# Altium project Single-Ended to Differential Converter v1.0.0.PrjPcb
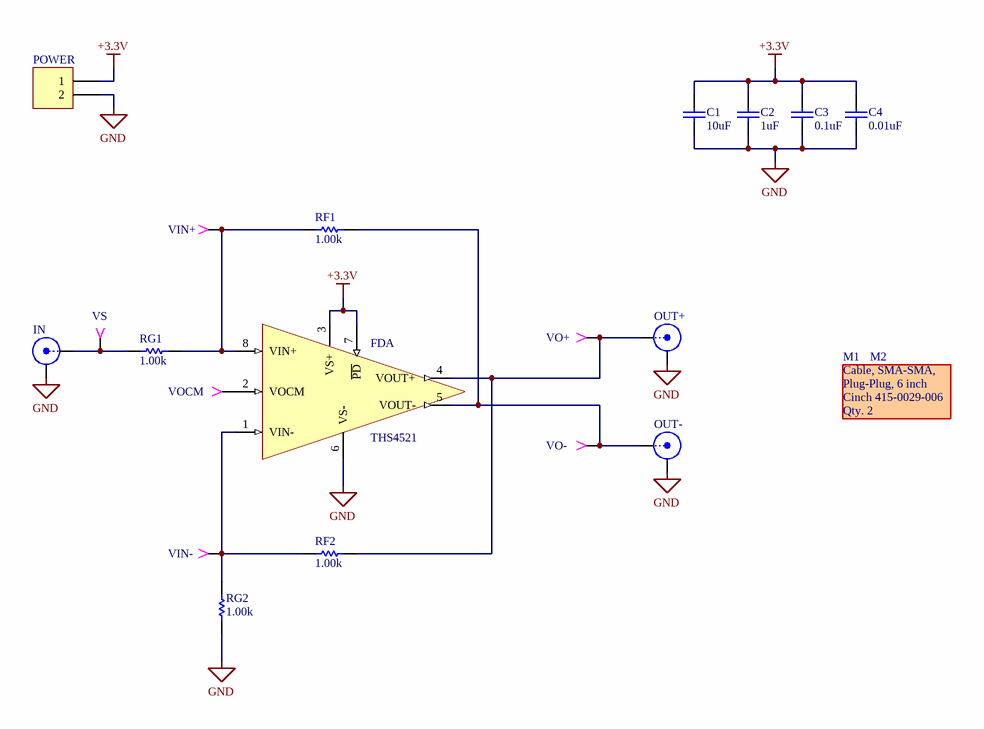
[diagram p0: SE2D v1.0.0.SchDoc]
sheetcount: 1; revisionfull: v1.0.0; revision: v1.0
1 sheet, 21 parts. Net scope: global (net labels, ports and power ports of the same name join across sheets).
Board file: SE2D v1.0.PcbDoc

## Sheet SE2D v1.0.0.SchDoc: PSDT: Single-Ended to Differential Adapter
size Letter; CompanyName: Probe-Scope; Organization: Probe-Scope; Address1: Probe-Scope: Unified USB; Address2: Oscilloscope Probe; Address3: ©2019 M. Omo, J. Rowley,; Address4: K. Hall, released under the; DocumentNumber: SCH0021; SheetNumber: 1; SheetTotal: 1; PageSetup: Record=PageOptions|CenterHorizontal=True|CenterVertical=True|PrintScale=0.96|XCorrection=1.00|YCorrection=1.00|PrintKind=1|BorderSize=5000000|LeftOffset=0|BottomOffset=0|Orientation=2|PaperLength=1000|PaperWidth=1000|Scale=100|PaperSource=7|PrintQuality=-4|MediaType=1|DitherType=10|PaperKind=11x17|PrintScaleMode=1; Assembly: ASP0021; License: CERN OHL v1.2

### Parts
C1  value 10uF  [0603(1608)]  (hidden comment: 25V)
C2  value 1uF  [0603(1608)]  (hidden comment: 25V)
C3  value 0.1uF  [0603(1608)]  (hidden comment: 50V)
C4  value 0.01uF  [0603(1608)]  (hidden comment: 50V)
FDA  THS4521  [TI_D0008A]
IN  R/A  [BNC - Right Angle]  (value not drawn)
M1  Qty. 2  Class: Cable, SMA-SMA,  Type: Plug-Plug, 6 inch  Other: Cinch 415-0029-006  (mechanical)
M2  Qty. 2  Class: Cable, SMA-SMA,  Type: Plug-Plug, 6 inch  Other: Cinch 415-0029-006  (mechanical)
OUT+  SMA-J-P-H-ST-EM1  [*SMA-J-P-H-ST-EM1_SMA-J-P-H-ST-EM1(Primary)]  (value not drawn)
OUT-  SMA-J-P-H-ST-EM1  [*SMA-J-P-H-ST-EM1_SMA-J-P-H-ST-EM1(Primary)]  (value not drawn)
POWER  *  [0.1HDR1X2P]  (value not drawn)
RF1  value 1.00k  [0603(1608)]  (hidden comment: Res1)
RF2  value 1.00k  [0603(1608)]  (hidden comment: Res1)
RG1  value 1.00k  [0603(1608)]  (hidden comment: Res1)
RG2  value 1.00k  [0603(1608)]  (hidden comment: Res1)
VIN+  TP  [TESTPOINT024]  (value not drawn)
VIN-  TP  [TESTPOINT024]  (value not drawn)
VO+  TP  [TESTPOINT024]  (value not drawn)
VO-  TP  [TESTPOINT024]  (value not drawn)
VOCM  TP  [TESTPOINT024]  (value not drawn)
VS  TP  [TESTPOINT024]  (value not drawn)

### Nets
+3.3V: C1.2 C2.2 C3.2 C4.2 FDA.3(VS+) FDA.7(~{PD}) POWER.1
GND: C1.1 C2.1 C3.1 C4.1 FDA.6(VS-) IN.2(Y) OUT+.2(Y) OUT-.2(Y) POWER.2 RG2.1
NetFDA_1: FDA.1(VIN-) RF2.1 RG2.2 VIN-.1
NetFDA_2: FDA.2(VOCM) VOCM.1
NetFDA_4: FDA.4(VOUT+) OUT+.1(X) RF2.2 VO+.1
NetFDA_5: FDA.5(VOUT-) OUT-.1(X) RF1.2 VO-.1
NetFDA_8: FDA.8(VIN+) RF1.1 RG1.2 VIN+.1
NetIN_1: IN.1(X) RG1.1 VS.1

### Notes on the sheet
- Title:
- Asm:
- Date:
- Variant:
- Time:
- Number:
- Sheet
- of
- Rev:
- File:

### Library data of the parts
C1 = 1306: Key: 1306; MENG_PN: ???1306; MANF: Samsung Electro-Mechanics; MANF_PN: CL10A106MA8NRNC; VENDOR: Digikey; VENDOR_PN: 1276-1869-1-ND; P&V Description: Capacitor, Ceramic, 10uF, 25V, 20% Tol, 85C, X5R, 0603, SMD; Class: Capacitor; Type: Ceramic; Other: X5R; Tolerance: 20; Voltage: 25; Max Temperature: 85; Approved: True; Package: 0603; SMD: True; Date Modified: 3/3/2015 11:08:29 AM; Modified By: sotterbacher; Parent Key: 1306; Verified: True
C2 = 1145: Key: 1145; MENG_PN: ???1145; MANF: Taiyo Yuden; MANF_PN: TMK107BJ105KA-T; VENDOR: Digikey; VENDOR_PN: 587-1248-1-ND; P&V Description: Capacitor, Ceramic, 1uF, 25V, 10% Tol, 125C, X5R, 0603, SMD; Class: Capacitor; Type: Ceramic; Other: X5R; Tolerance: 10; Voltage: 25; Max Temperature: 125; Approved: True; Package: 0603; SMD: True; Date Modified: 5/24/2014 3:50:24 PM; Modified By: pmarcus; Parent Key: 1145; Verified: True
C3 = 751: Key: 751; MENG_PN: ???751; MANF: Samsung Electro-Mechanics; MANF_PN: CL10B104KB8SFNC; VENDOR: Digikey; VENDOR_PN: 1276-1936-1-ND; P&V Description: Capacitor, Ceramic, 0.1uF, 50V, 10% Tol, 125C, X7R, 0603, SMD; Class: Capacitor; Type: Ceramic; Other: X7R; Tolerance: 10; Voltage: 50; Max Temperature: 125; Approved: True; Package: 0603; SMD: True; Date Modified: 10/21/2014 3:48:37 PM; Modified By: pmarcus; Parent Key: 751; Verified: True
C4 = 1703: Key: 1703; MENG_PN: ???1703; MANF: Samsung Electro-Mechanics; MANF_PN: CL10B103KB8NCNC; VENDOR: Digikey; VENDOR_PN: 1276-1921-1-ND; P&V Description: Capacitor, Ceramic, 0.01uF, 50V, 10% Tol, 125C, X7R, 0603, SMD; Class: Capacitor; Type: Ceramic; Other: X7R; Tolerance: 10; Voltage: 50; Max Temperature: 125; Approved: False; Package: 0603; SMD: True; Date Modified: 7/5/2018 1:16:07 PM; Modified By: jrowley; Parent Key: 1703; Verified: False
FDA = THS4521IDR: VENDOR: Digikey; MANF: Texas Instruments; VENDOR_PN: 296-39226-1-ND; MANF_PN: THS4521IDR
IN = 866: Key: 866; MENG_PN: ???866; MANF: Tyco; MANF_PN: 1-1337543-0; VENDOR: Digikey; VENDOR_PN: A97553-ND; P&V Description: Connector, BNC, 1 Positions, Female, Right Angle, Plastic, 50 Ohm Termination, PCB; Class: Connector; Other: Right Angle, Plastic, 50 Ohm Termination, PCB; Positions: 1; Sex: Female; Approved: True; Type: BNC; SMD: False; Date Modified: 9/26/2012 4:24:05 PM; Modified By: pmarcus; Parent Key: 866; Verified: True
M1 M2 = SMA PLUG-PLUG 6: MANF: Cinch Connectivity Solutions Johnson; MANF_PN: 415-0029-006; VENDOR: Digikey; VENDOR_PN: J3706-ND
OUT+ OUT- = SMA-J-P-H-ST-EM1: MANF: Samtec Inc.; VENDOR: Digikey; VENDOR_PN: SAM8857-ND; MANF_PN: SMA-J-P-H-ST-EM1
POWER = 375: Key: 375; MENG_PN: CON00068; MANF: Molex; VENDOR: Digikey; VENDOR_PN: WM2700-ND; P&V Description: Connector, Header, 0.1", 2 Positions, Male, 0.1" Spacing, 4A, 250V, 0.24" Long, 0.125" Tail, 15u Select Gold, Polarized, Locking Ramp; Class: Connector; Other: 0.24" Long, 0.125" Tail, 15u Select Gold, Polarized, Locking Ramp; Current: 4; Voltage: 250; Positions: 2; Spacing: 0.1; Sex: Male; Approved: False; MANF_PN: 22-11-2022; Type: Header, 0.1"; SMD: False; Date Modified: 7/21/2017 2:28:28 PM; Modified By: jrowley; Parent Key: 375; Verified: False
RF1 RF2 RG1 RG2 = 735: Key: 735; MENG_PN: ???735; MANF: Yageo; MANF_PN: RC0603FR-071KL; VENDOR: Digikey; VENDOR_PN: 311-1.00KHRCT-ND; P&V Description: Resistor, Thick Film, 1.00k Ohms, 0.1W, 1% Tol, 75V, 0603, SMD; Class: Resistor; Tolerance: 1; Power: 0.1; Voltage: 75; Approved: False; Type: Thick Film; Package: 0603; SMD: True; Date Modified: 2/21/2018 9:28:06 AM; Modified By: khall; Expr1026: 735; Parent Key: 735; Verified: False
VIN+ VIN- VO+ VO- VOCM VS = 49: Key: 49; MENG_PN: CON00002; MANF: Keystone Electronics; MANF_PN: 1998-3; VENDOR: Digikey; VENDOR_PN: 1998-3K-ND; P&V Description: Connector, Test Point, 1 Positions, Male, Small, 0.27" Straight Pin, 0.02" dia; Class: Connector; Other: Small, 0.27" Straight Pin, 0.02" dia; Approved: True; Positions: 1; Sex: Male; Type: Test Point; SMD: False; Date Modified: 9/30/2014 10:31:54 AM; Parent Key: 49; Verified: True; Modified By: sotterbacher

## Assembly variants
Standard Configuration: all parts fitted